# EAGLE design power electronics (EAGLE 9.2.2)
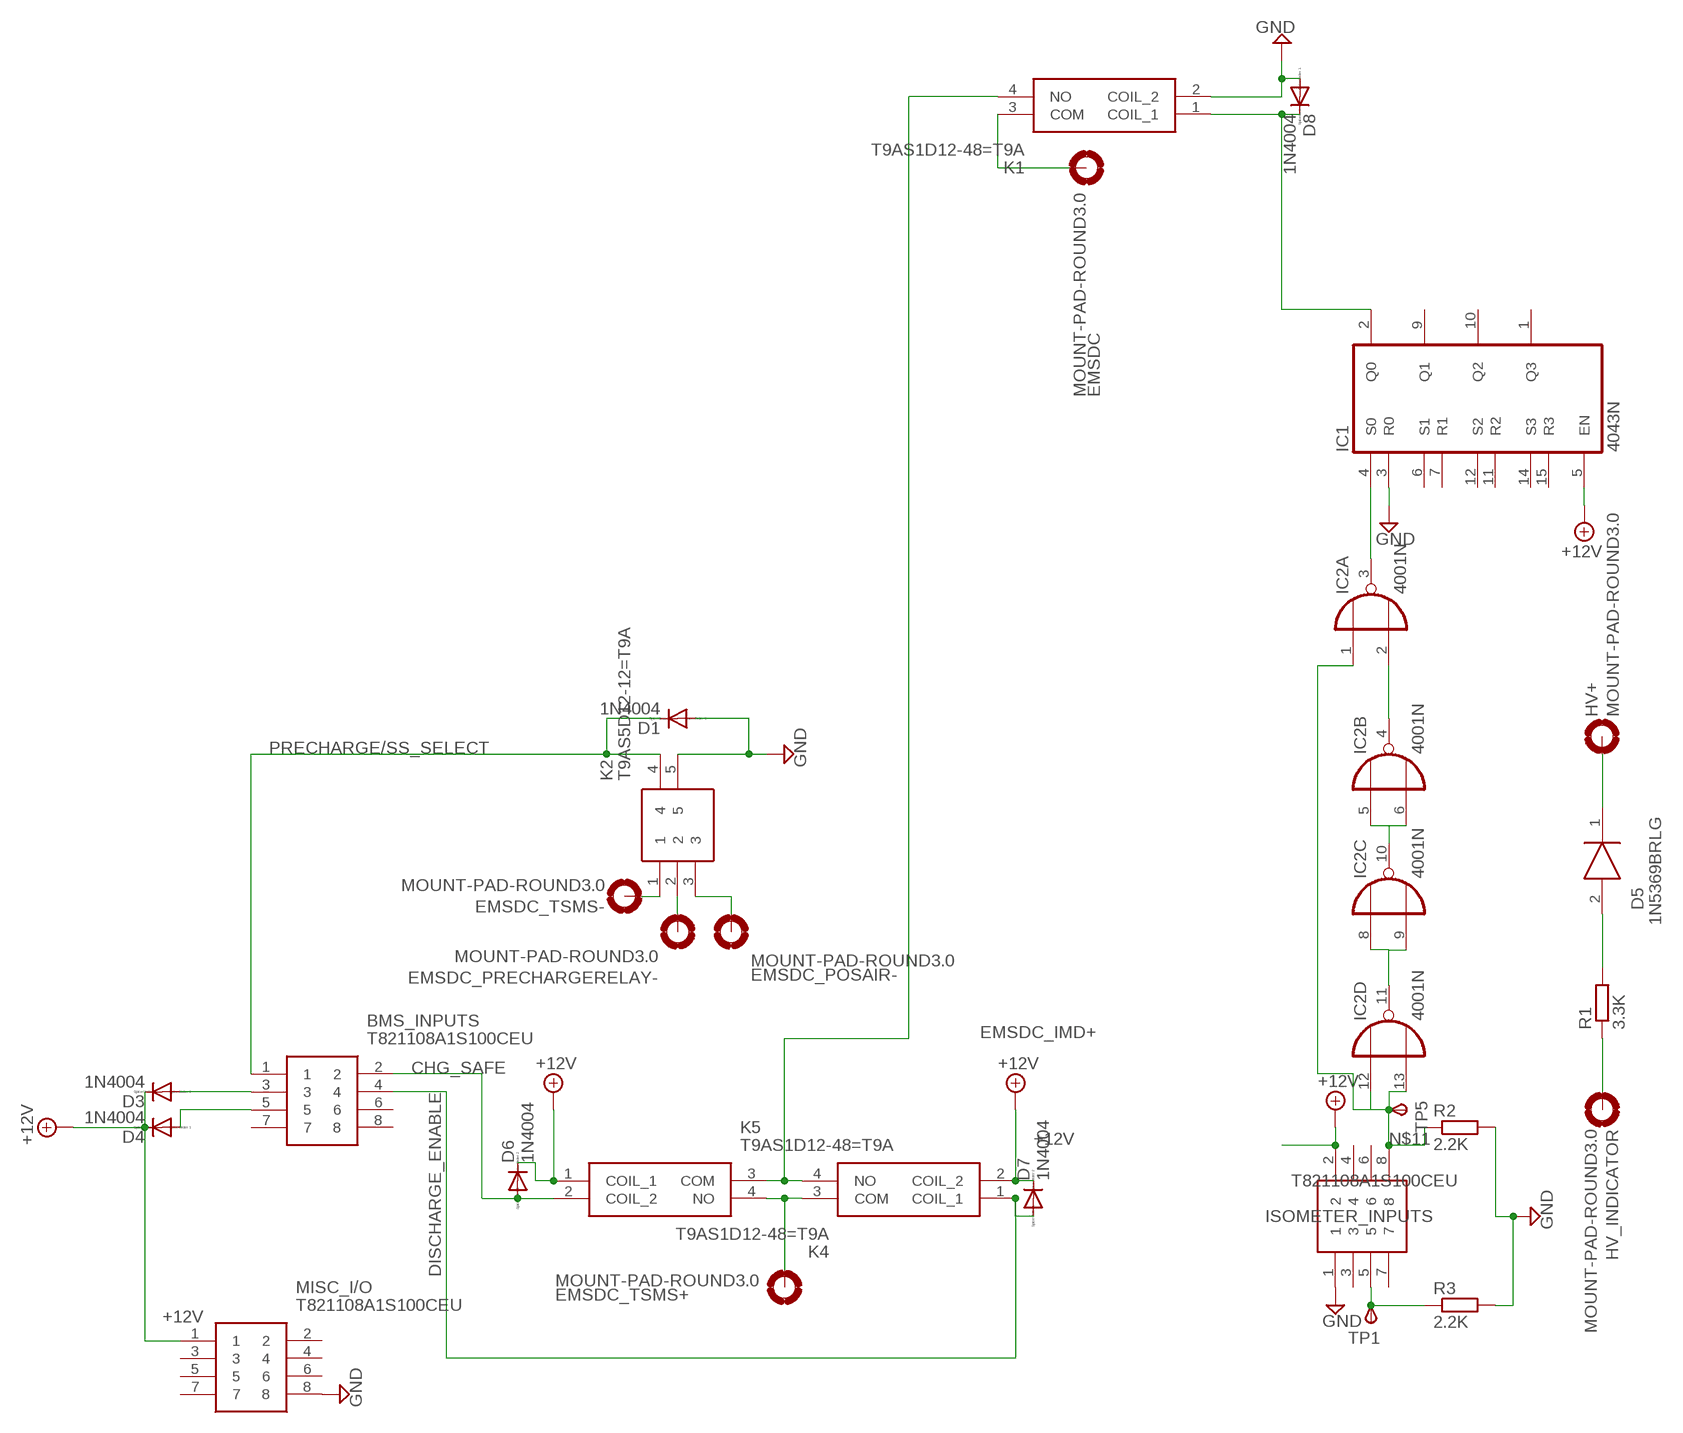
[diagram p0: schematic, sheet 1]

## Parts
BMS_INPUTS  T821108A1S100CEU  [HDRV8W64P254_2X4_1778X895X915P]
D1  1N4004  [DO41-10]
D3  1N4004  [DO41-10]
D4  1N4004  [DO41-10]
D5  1N5369BRLG  [DIOAD2260W109L864D349]
D6  1N4004  [DO41-10]
D7  1N4004  [DO41-10]
D8  1N4004  [DO41-10]
EMSDC  MOUNT-PAD-ROUND3.0  [3,0-PAD]
EMSDC_POSAIR-  MOUNT-PAD-ROUND3.0  [3,0-PAD]
EMSDC_PRECHARGERELAY-  MOUNT-PAD-ROUND3.0  [3,0-PAD]
EMSDC_TSMS+  MOUNT-PAD-ROUND3.0  [3,0-PAD]
EMSDC_TSMS-  MOUNT-PAD-ROUND3.0  [3,0-PAD]
HV+  MOUNT-PAD-ROUND3.0  [3,0-PAD]
HV_INDICATOR  MOUNT-PAD-ROUND3.0  [3,0-PAD]
IC1  4043N  [DIL16]
IC2  4001N  [DIL14]
ISOMETER_INPUTS  T821108A1S100CEU  [HDRV8W64P254_2X4_1778X895X915P]
K1  T9AS1D12-48=T9A  [T9AS1D1248T9A]
K2  T9AS5D12-12=T9A  [T9AS1D12]
K4  T9AS1D12-48=T9A  [T9AS1D1248T9A]
K5  T9AS1D12-48=T9A  [T9AS1D1248T9A]
MISC_I/O  T821108A1S100CEU  [HDRV8W64P254_2X4_1778X895X915P]
R1  3.3K  R-EU_0207/15  [0207/15]
R2  2.2K  R-EU_0207/12  [0207/12]
R3  2.2K  R-EU_0207/12  [0207/12]
TP1  TPSPAD1-17  [P1-17]
TP5  TPSPAD1-17  [P1-17]

## Nets
+12V: D3.C D4.C D6.C D7.C IC1.5(EN) ISOMETER_INPUTS.2 K4.2(COIL_2) K5.1(COIL_1) MISC_I/O.1
CHG_SAFE: BMS_INPUTS.2 D6.A K5.2(COIL_2)
DISCHARGE_ENABLE: BMS_INPUTS.4 D7.A K4.1(COIL_1)
EMSDC_IMD+: K1.4(NO) K4.4(NO) K5.3(COM)
GND: D1.A D8.A IC1.3(R0) ISOMETER_INPUTS.1 K1.2(COIL_2) K2.5 MISC_I/O.8 R2.2 R3.2
N$1: EMSDC_TSMS-.B3,0(MOUNT) K2.1
N$2: EMSDC_POSAIR-.B3,0(MOUNT) K2.3
N$3: EMSDC_PRECHARGERELAY-.B3,0(MOUNT) K2.2
N$4: EMSDC_TSMS+.B3,0(MOUNT) K4.3(COM) K5.4(NO)
N$5: D5.1(K) HV+.B3,0(MOUNT)
N$6: BMS_INPUTS.3 D3.A
N$7: D5.2(A) R1.2
N$8: BMS_INPUTS.5 D4.A
N$9: HV_INDICATOR.B3,0(MOUNT) R1.1
N$10: ISOMETER_INPUTS.5 R3.1 TP1.TP(PP)
N$11: IC2.1(A:I0) IC2.12(D:I0) IC2.13(D:I1) ISOMETER_INPUTS.8 R2.1 TP5.TP(PP)
N$12: IC2.8(C:I0) IC2.9(C:I1) IC2.11(D:O)
N$13: IC2.5(B:I0) IC2.6(B:I1) IC2.10(C:O)
N$14: IC2.2(A:I1) IC2.4(B:O)
N$15: D8.C IC1.2(Q0) K1.1(COIL_1)
N$16: EMSDC.B3,0(MOUNT) K1.3(COM)
N$17: IC1.4(S0) IC2.3(A:O)
PRECHARGE/SS_SELECT: BMS_INPUTS.1 D1.C K2.4
Unconnected: BMS_INPUTS.6 BMS_INPUTS.7 BMS_INPUTS.8 IC1.1(Q3) IC1.6(S1) IC1.7(R1) IC1.9(Q1) IC1.10(Q2) IC1.11(R2) IC1.12(S2) IC1.14(S3) IC1.15(R3) ISOMETER_INPUTS.3 ISOMETER_INPUTS.4 ISOMETER_INPUTS.6 ISOMETER_INPUTS.7 MISC_I/O.2 MISC_I/O.3 MISC_I/O.4 MISC_I/O.5 MISC_I/O.6 MISC_I/O.7

## Power pins joined to a net without a drawn wire
VDD: IC1.16(VDD) IC2.14(P:VDD)
VSS: IC1.8(VSS) IC2.7(P:VSS)

## Library data of the parts
BMS_INPUTS ISOMETER_INPUTS MISC_I/O = SamacSys_Parts:T821108A1S100CEU: HEADER, VERTICAL, 2.54MM, 8WAY Amphenol T821 Series, 2.54mm Pitch 8 Way 2 Row Straight PCB Header, Solder Termination, 3A Source: Datasheet <http://uk.rs-online.com/web/p/products/8323569>; DESCRIPTION: HEADER, VERTICAL, 2.54MM, 8WAY Amphenol T821 Series, 2.54mm Pitch 8 Way 2 Row Straight PCB Header, Solder Termination, 3A; HEIGHT: 9.15mm; MANUFACTURER_NAME: Amphenol; MANUFACTURER_PART_NUMBER: T821108A1S100CEU; RS_PART_NUMBER: 8323569; RS_PRICE-STOCK: http://uk.rs-online.com/web/p/products/8323569
D1 D3 D4 D6-D8 = diode:1N4004: DIODE general purpose rectifier, 1 A
D5 = SamacSys_Parts:1N5369BRLG: Zener Diode, 51V 5% 5 W Through Hole 2-pin DO-15 Source: Datasheet <http://uk.rs-online.com/web/p/products/6547678P>; ALLIED_NUMBER: 70339233; DESCRIPTION: Zener Diode, 51V 5% 5 W Through Hole 2-pin DO-15; HEIGHT: mm; MANUFACTURER_NAME: ON Semiconductor; MANUFACTURER_PART_NUMBER: 1N5369BRLG; RS_PART_NUMBER: 6547678P; RS_PRICE-STOCK: http://uk.rs-online.com/web/p/products/6547678P
EMSDC EMSDC_POSAIR- EMSDC_PRECHARGERELAY- EMSDC_TSMS+ EMSDC_TSMS- HV+ HV_INDICATOR = holes:MOUNT-PAD-ROUND: MOUNTING PAD, round
IC1 = 40xx:4043: Quad 3-state NOR R/S LATCH
IC2 = 40xx:4001: Quad 2-input NOR
K1 K4 K5 = SamacSys_Parts:T9AS1D12-48=T9A: SPST-NO PCB Mount Non-Latching Relay Through Hole, 48V dc Source: Datasheet <http://uk.rs-online.com/web/p/products/6802534P>; DESCRIPTION: SPST-NO PCB Mount Non-Latching Relay Through Hole, 48V dc; HEIGHT: 20.4mm; MANUFACTURER_NAME: TE Connectivity; MANUFACTURER_PART_NUMBER: T9AS1D12-48=T9A; RS_PART_NUMBER: 6802534P; RS_PRICE-STOCK: http://uk.rs-online.com/web/p/products/6802534P
K2 = SamacSys_Parts:T9AS5D12-12=T9A: PCB Relay SPDT 30A 12Vdc,thru hole SPDT PCB Mount Non-Latching Relay Through Hole, 12V dc Source: Datasheet; ALLIED_NUMBER: R1111589; DESCRIPTION: PCB Relay SPDT 30A 12Vdc,thru hole SPDT PCB Mount Non-Latching Relay Through Hole, 12V dc; HEIGHT: mm; MANUFACTURER_NAME: TE Connectivity; MANUFACTURER_PART_NUMBER: T9AS5D12-12=T9A; RS_PART_NUMBER: 6802528; RS_PRICE-STOCK: https://uk.rs-online.com/web/p/products/6802528
R1-R3 = rcl:R-EU_: RESISTOR, European symbol; SPICEPREFIX: R
TP1 TP5 = testpad:TPS: TEST PIN

## Board
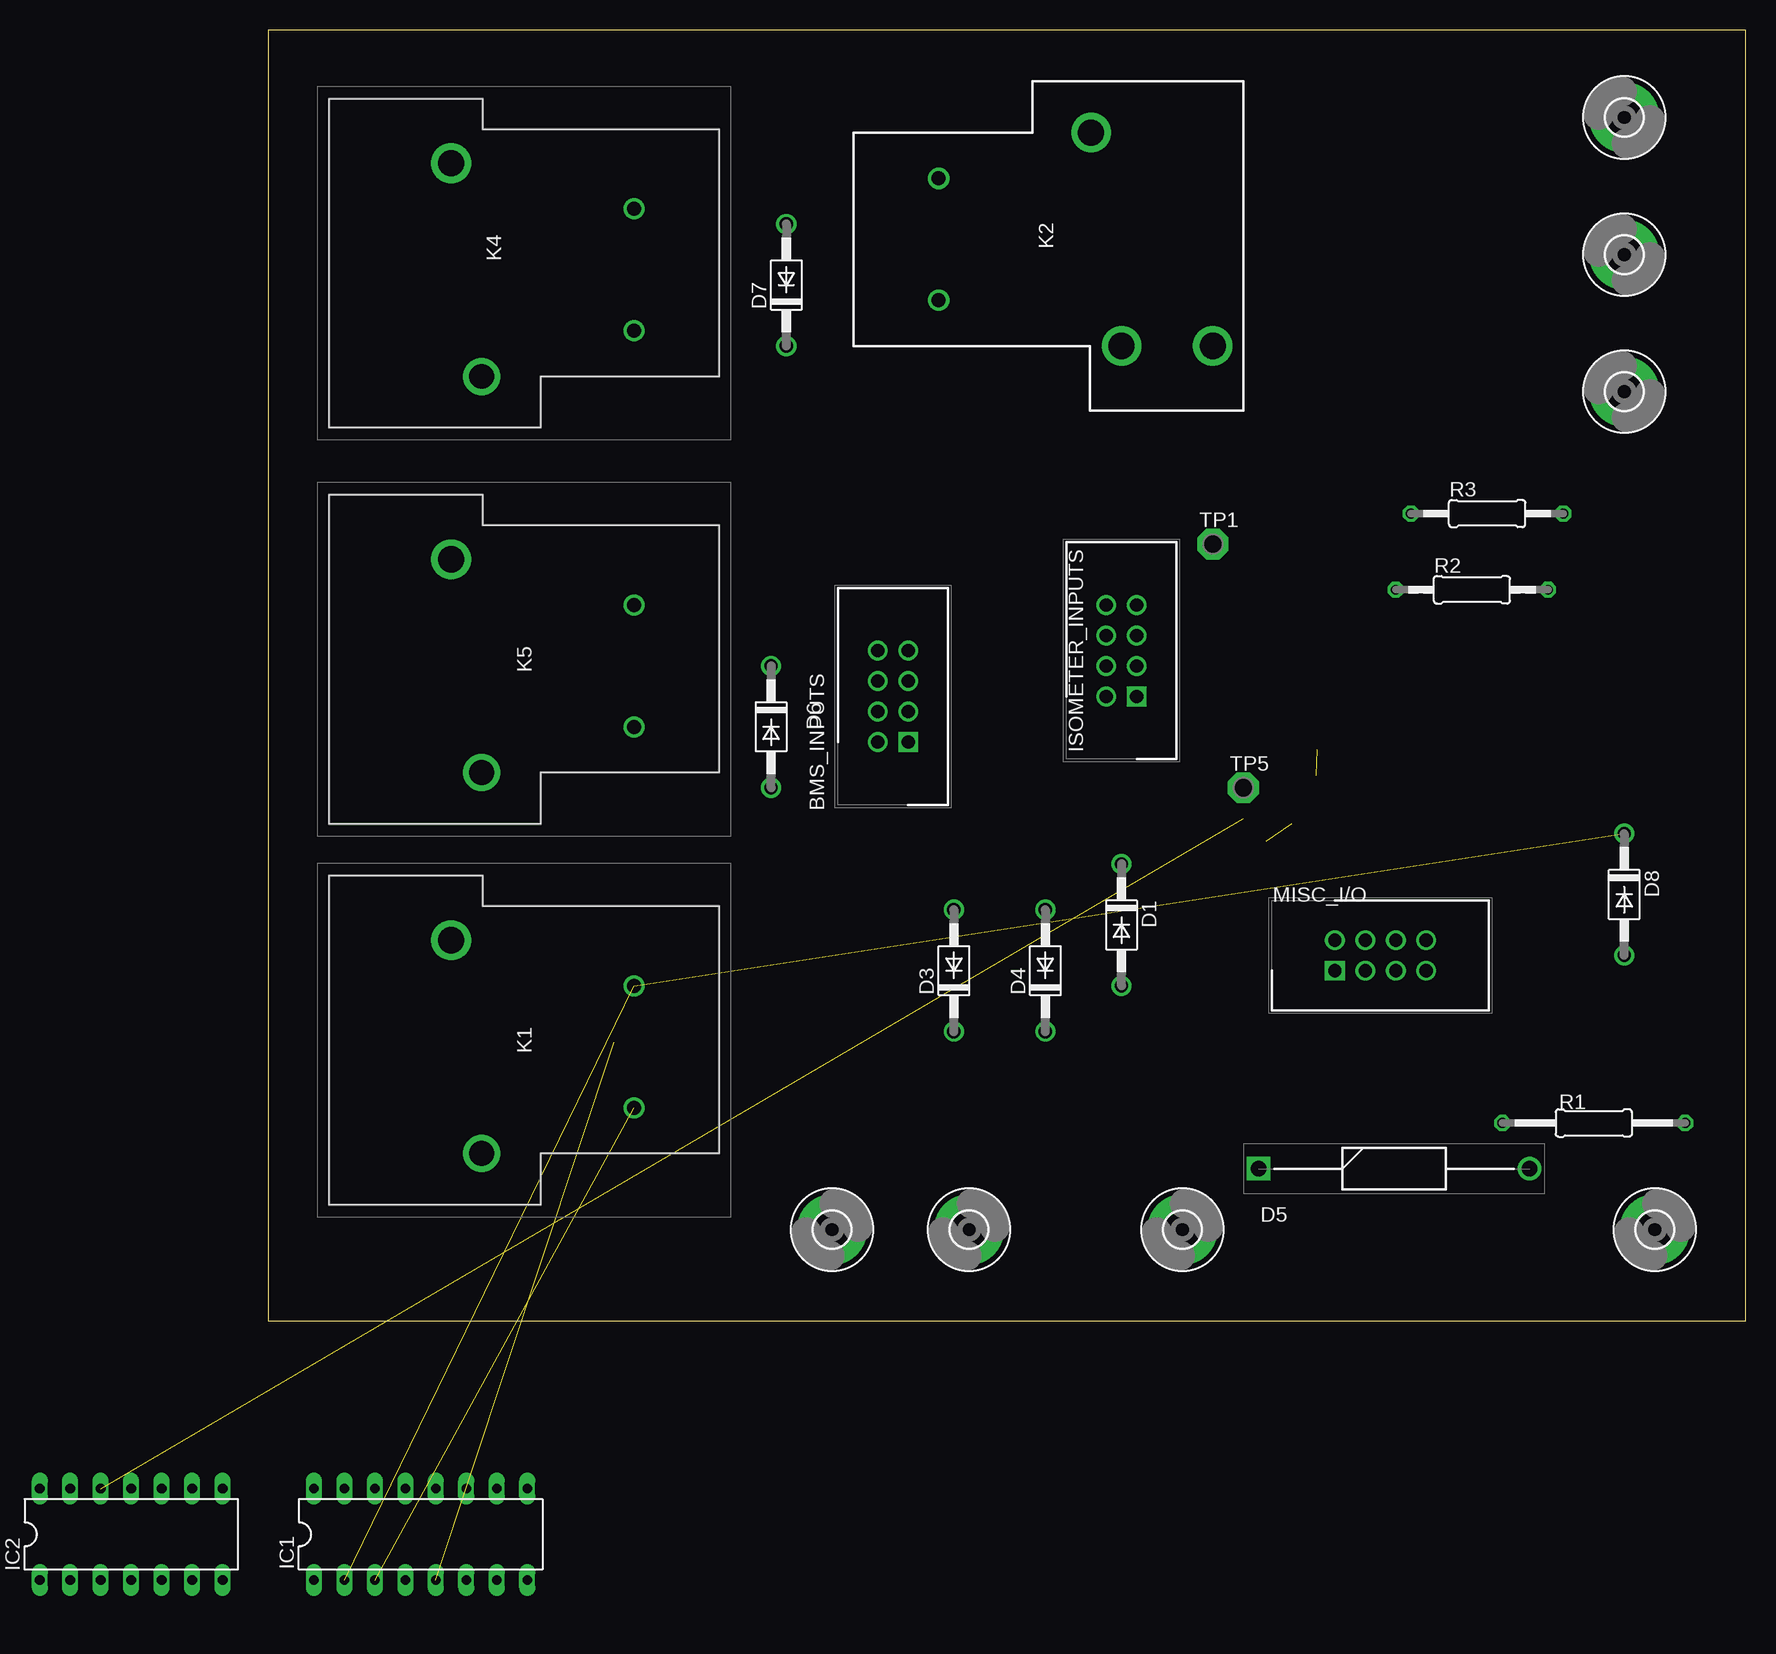
[diagram p1: board, top side]
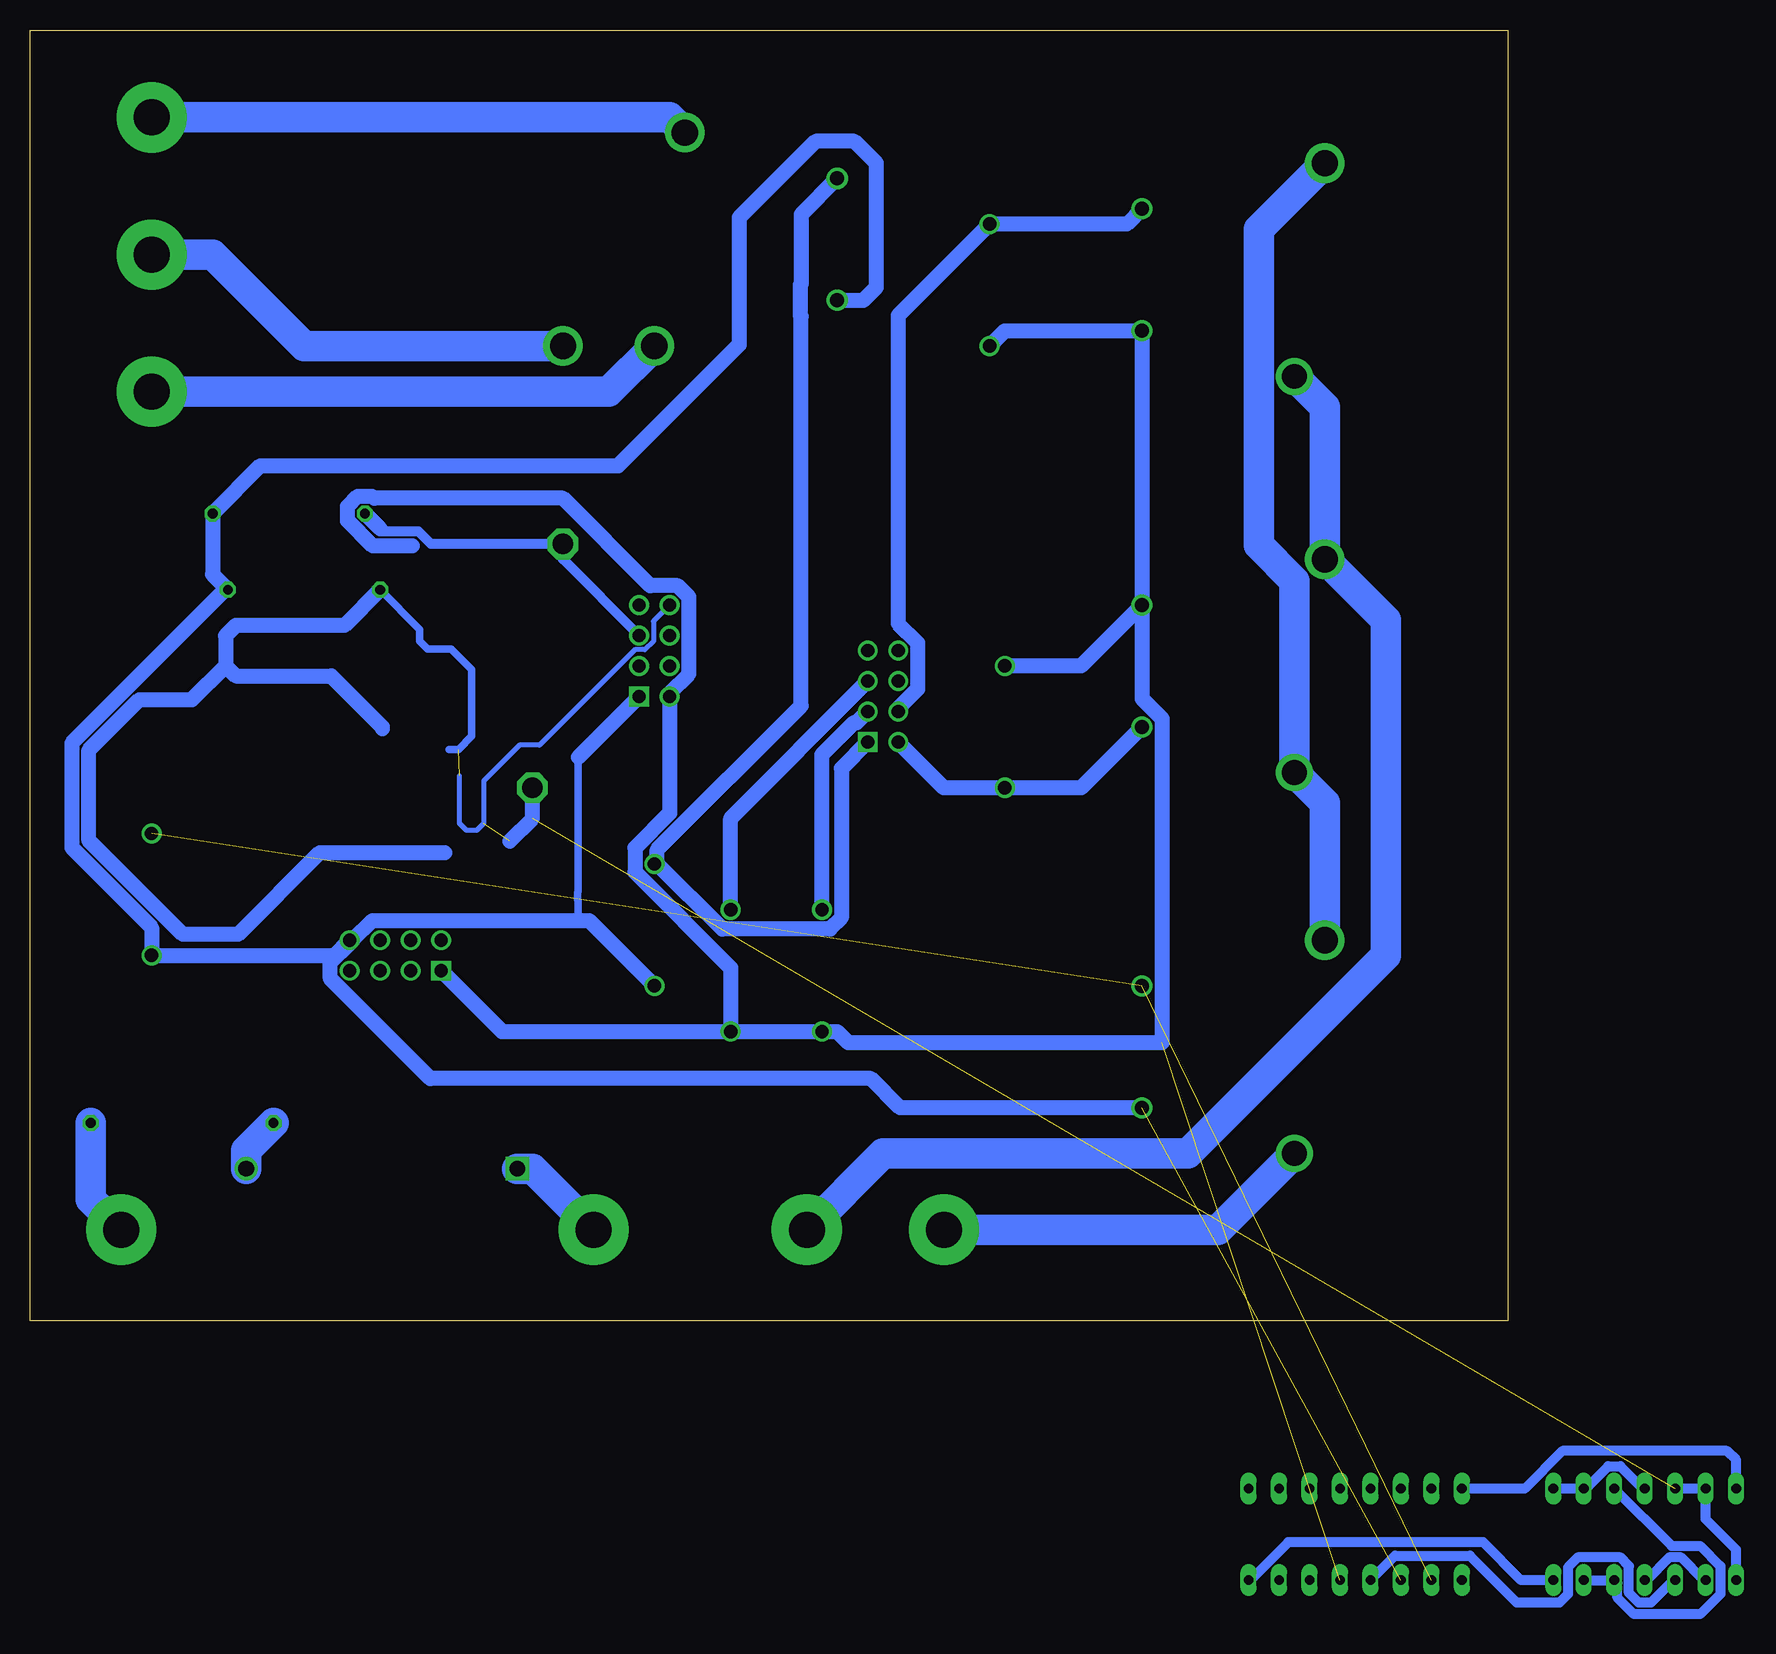
[diagram p2: board, bottom side, seen from below]

Size 123.17 x 107.62 mm. Coordinates in mm from the lower left corner, seen from the top.
Outline: 0,0 123.17,0 123.17,107.62 0,107.62 0,0
Copper layers (1*16): Top 0.035mm / dielectric 1.5mm / Bottom 0.035mm
Design rules "default": minimum track width 6mil, minimum drill 0.35mm, track to track 6mil, track to pad 6mil, pad to pad 6mil, via to via 6mil, smd to smd 6mil, copper to edge 40mil, drill to drill 6mil, minimum pad ring 10mil, minimum via ring 8mil, stop-mask expansion 4mil, vias tented up to drill 0mil, thermal gap 10mil

### Footprints (pad centres in the part's own frame; a part is rotated, then mirrored left to right if it is on the bottom)
HDRV8W64P254_2X4_1778X895X915P = drill 1.1 pad 1.65 square: 1 0,0 | drill 1.1 pad 1.65: 2 0,2.54; 3 2.54,0; 4 2.54,2.54; 5 5.08,0; 6 5.08,2.54; 7 7.62,0; 8 7.62,2.54
DO41-10 = drill 1.118: A 5.08,0; C -5.08,0
DIOAD2260W109L864D349 = drill 1.3 pad 1.95 square: 1 0,0 | drill 1.3 pad 1.95: 2 22.6,0
3,0-PAD = drill 3 pad 5.842: B3,0 0,0
DIL16 = drill 0.813 long: 1 -8.89,-3.81; 2 -6.35,-3.81; 3 -3.81,-3.81; 4 -1.27,-3.81; 5 1.27,-3.81; 6 3.81,-3.81; 7 6.35,-3.81; 8 8.89,-3.81; 9 8.89,3.81; 10 6.35,3.81; 11 3.81,3.81; 12 1.27,3.81; 13 -1.27,3.81; 14 -3.81,3.81; 15 -6.35,3.81; 16 -8.89,3.81
DIL14 = drill 0.813 long: 1 -7.62,-3.81; 2 -5.08,-3.81; 3 -2.54,-3.81; 4 0,-3.81; 5 2.54,-3.81; 6 5.08,-3.81; 7 7.62,-3.81; 8 7.62,3.81; 9 5.08,3.81; 10 2.54,3.81; 11 0,3.81; 12 -2.54,3.81; 13 -5.08,3.81; 14 -7.62,3.81
T9AS1D1248T9A = drill 1.17 pad 1.755: 1 0,0; 2 -10.16,0 | drill 2.06 pad 3.09: 3 -13.97,12.7 | drill 2.19 pad 3.3: 4 3.81,15.24
T9AS1D12 = drill 2.19 pad 3.29: 1 -8.89,12.7; 2 8.89,15.24; 3 8.89,22.86 | drill 1.17 pad 1.77: 4 -5.08,0; 5 5.08,0
0207/15 = drill 0.813 octagon: 1 -7.62,0; 2 7.62,0
0207/12 = drill 0.813 octagon: 1 -6.35,0; 2 6.35,0
P1-17 = drill 1.702 pad 2.54 octagon: TP 0,0

### Placement (x,y rotation side)
BMS_INPUTS  53.34,48.26 90 top
D1  71.12,33.02 270 top
D3  57.15,29.21 90 top
D4  64.77,29.21 90 top
D5  82.55,12.7 0 top
D6  41.91,49.53 270 top
D7  43.18,86.36 90 top
D8  113.03,35.56 270 top
EMSDC  46.99,7.62 0 top
EMSDC_POSAIR-  113.03,88.9 270 top
EMSDC_PRECHARGERELAY-  113.03,77.47 270 top
EMSDC_TSMS+  58.42,7.62 0 top
EMSDC_TSMS-  113.03,100.33 270 top
HV+  76.2,7.62 180 top
HV_INDICATOR  115.57,7.62 0 top
IC1  12.7,-17.78 0 top  (outside the outline)
IC2  -11.43,-17.78 0 top  (outside the outline)
ISOMETER_INPUTS  72.39,52.07 90 top
K1  30.48,27.94 90 top
K2  55.88,90.17 270 top
K4  30.48,92.71 90 top
K5  30.48,59.69 90 top
MISC_I/O  88.9,29.21 0 top
R1  110.49,16.51 180 top
R2  100.33,60.96 0 top
R3  101.6,67.31 0 top
TP1  78.74,64.77 0 top
TP5  81.28,44.45 0 top

### Tracks (layer width: path | path; a pad name or v marks a point on that pad's centre or on a via)
+12V  (1 unrouted)
  Bottom 1.27: D7.C 41.91,82.55 K4.2 K5.1 | K5.1 35.56,54.61 D6.C | MISC_I/O.1 83.82,24.13 D4.C | D4.C D3.C 55.88,24.13 54.97,23.22 28.82,23.22 28.82,50.22 30.48,51.88 K5.1 | D4.C 64.77,29.45 72.75,37.43 72.75,39.44 69.85,42.33 ISOMETER_INPUTS.2 69.85,52.33 68.24,53.94 68.24,60.36 69.18,61.3 71.46,61.3 78.74,68.58 94.47,68.58 94.65,68.76 95.85,68.76 96.7,67.91 96.7,66.71 94.61,64.62 91.29,64.62
CHG_SAFE
  Bottom 1.27: K5.2 35.56,44.45 D6.A 46.99,44.45 BMS_INPUTS.2
DISCHARGE_ENABLE
  Bottom 1.27: K4.1 31.75,91.44 D7.A 50.8,83.82 50.8,58.16 49.19,56.55 49.19,52.67 50.8,51.06 BMS_INPUTS.4
EMSDC_IMD+
  Bottom 2.54: K1.4 15.24,43.18 K5.3 17.78,61.7 20.75,64.66 20.75,91.01 K4.4
GND  (1 unrouted)
  Bottom 0.61: 77.47,33.36 77.47,35.04 77.53,35.1 77.53,35.73 77.47,35.79 77.47,46.99
  Bottom 1.27: MISC_I/O.8 97.79,30.48 D8.A 113.03,32.81 119.69,39.46 119.69,48.17 106.89,60.96 R2.2 107.95,62.23 R3.2 103.96,71.3 74.14,71.3 64.06,81.39 64.06,91.98 57.69,98.34 54.44,98.34 52.62,96.52 52.62,86.17 53.69,85.09 K2.5 | K1.2 50.64,17.78 53.07,20.22 89.81,20.22 98.13,28.54 98.13,29.88 96.52,31.49 MISC_I/O.8 | MISC_I/O.8 96.26,31.75 94.65,33.36 77.47,33.36 76.54,33.36 D1.A | ISOMETER_INPUTS.1 77.47,46.99
N$1
  Bottom 2.54: EMSDC_TSMS-.B3,0 69.85,100.33 K2.1
N$2
  Bottom 2.54: EMSDC_POSAIR-.B3,0 107.95,88.9 100.33,81.28 K2.3
N$3
  Bottom 2.54: EMSDC_PRECHARGERELAY-.B3,0 74.93,77.47 K2.2
N$4
  Bottom 2.54: K4.3 15.24,76.2 K5.4 10.16,58.42 10.16,30.48 26.67,13.97 52.07,13.97 EMSDC_TSMS+.B3,0
N$5
  Bottom 2.54: D5.1 81.28,12.7 HV+.B3,0
N$6
  Bottom 1.27: BMS_INPUTS.3 54.27,49.87 54.49,49.87 57.15,47.21 D3.A
N$7
  Bottom 2.54: D5.2 105.15,14.23 R1.2
N$8
  Bottom 1.27: D4.A 64.77,41.91 BMS_INPUTS.5
N$9
  Bottom 2.54: R1.1 118.11,10.16 HV_INDICATOR.B3,0
N$10
  Bottom 0.813: 93.98,66.04 93.75,65.81 90.79,65.81 89.75,64.77 TP1.TP 78.74,63.5 ISOMETER_INPUTS.5
  Bottom 1.27: 93.98,66.04 R3.1
N$11  (3 unrouted)
  Bottom 0.406: ISOMETER_INPUTS.8 71.21,58.33 71.21,56.66 71.9,55.97 72.74,55.97 80.71,48.01 82.36,48.01 85.34,45.02 85.34,41.49 85.94,40.89 86.78,40.89 87.38,41.49 87.38,45.47
  Bottom 0.61: 88.24,47.65 87.46,47.65 86.36,48.75 86.36,54.31 88.08,56.03 90.02,56.03 90.68,56.69 90.68,57.66 R2.1
  Bottom 0.813: IC2.1 -19.05,-19.05 -16.51,-16.51 IC2.13 IC2.12
  Bottom 1.27: 106.86,54.62 106.86,57.14 106.01,57.99 96.95,57.99 R2.1 | 106.86,54.62 106.01,53.77 98.05,53.77 93.8,49.52 93.8,49.35 | 106.86,54.62 109.69,51.79 114.05,51.79 118.26,47.58 118.26,40.05 110.44,32.23 105.83,32.23 99.01,39.04 88.59,39.04 | 83.19,40.01 81.28,41.91 TP5.TP
N$12
  Bottom 0.813: IC2.8 IC2.9 -6.5,-13.97 -8.38,-12.09 -9.39,-12.09 -11.28,-13.97 IC2.11
N$13
  Bottom 0.813: IC2.6 IC2.5 -9.14,-21.84 -9.14,-23.05 -10.53,-24.43 -16.05,-24.43 -17.73,-22.75 -17.73,-20.43 -16.05,-18.75 -13.66,-18.75 IC2.10
N$14
  Bottom 0.813: IC2.2 -16.36,-21.59 -14.47,-19.71 -13.46,-19.71 -11.59,-21.59 IC2.4
N$15  (2 unrouted)
N$16
  Bottom 2.54: EMSDC.B3,0 24.13,7.62 K1.3
N$17
  Bottom 0.813: IC1.4 9.4,-19.56 3.15,-19.56 -0.77,-23.47 -4.32,-23.47 -5.03,-22.75 -5.03,-20.53 -5.84,-19.71 -9.39,-19.71 -10.11,-20.43 -10.11,-22.65 -10.93,-23.47 -11.94,-23.47 -13.81,-21.59 IC2.3
PRECHARGE/SS_SELECT
  Bottom 1.27: K2.4 58.9,92.23 58.9,86.45 58.98,86.37 58.98,83.81 58.9,83.73 58.9,51.28 70.88,39.29 70.88,38.1 | BMS_INPUTS.1 55.52,46.08 55.52,33.62 56.48,32.66 65.44,32.66 70.88,38.1 | 70.88,38.1 D1.C
VDD
  Bottom 0.813: IC1.16 -1.43,-13.97 -4.58,-10.82 -18.29,-10.82 -19.05,-11.59 IC2.14
VSS
  Bottom 0.813: IC2.7 -1.11,-21.59 2.04,-18.44 18.29,-18.44 21.43,-21.59 IC1.8